# Altium schematic sheet Analog.SchDoc
size A3
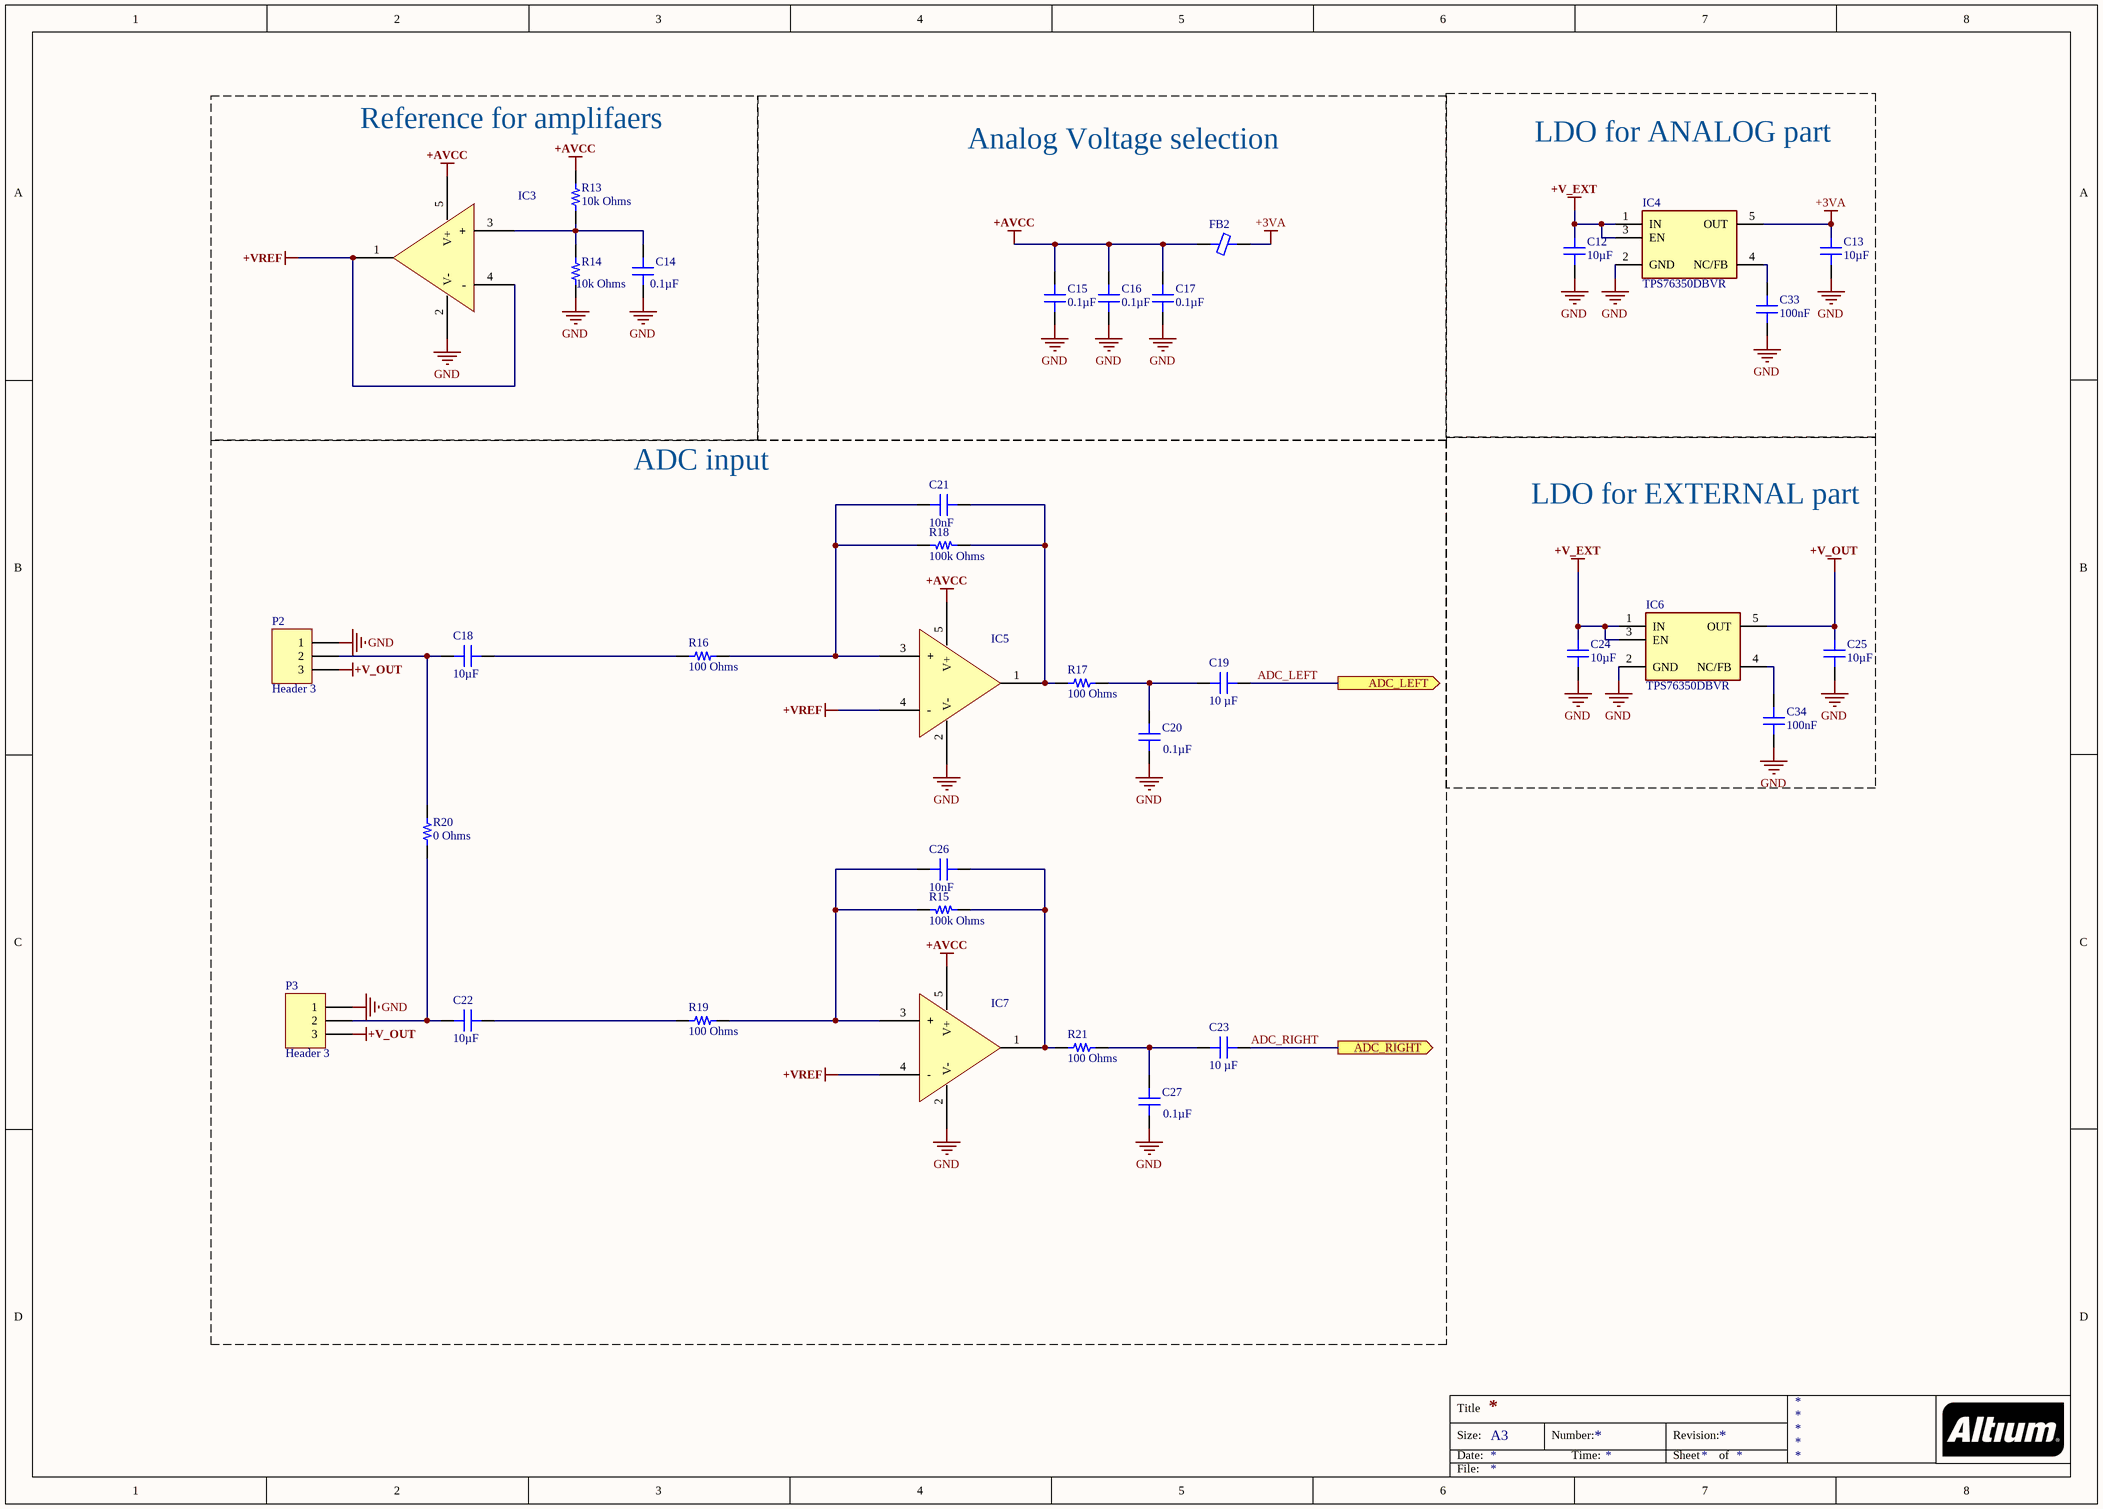
[diagram p0: Analog.SchDoc]

## Parts
C12  10µF  [CAP 0603_1608]
C13  10µF  [CAP 0603_1608]
C14  0.1µF  [CAP 0603_1608]
C15  0.1µF  [CAP 0603_1608]
C16  0.1µF  [CAP 0603_1608]
C17  0.1µF  [CAP 0603_1608]
C18  10µF  [CAP 0603_1608]
C19  10 µF  [CAP 0603_1608]
C20  0.1µF  [CAP 0603_1608]
C21  10nF  [CAP 0603_1608]
C22  10µF  [CAP 0603_1608]
C23  10 µF  [CAP 0603_1608]
C24  10µF  [CAP 0603_1608]
C25  10µF  [CAP 0603_1608]
C26  10nF  [CAP 0603_1608]
C27  0.1µF  [CAP 0603_1608]
C33  100nF  [CAP 0603_1608]
C34  100nF  [CAP 0603_1608]
FB2  (no value)  [FER 0603_1608]
IC3  AD8541ARTZ-REEL7  [ANALOG SOT-23-5 RJ-5]  (value not drawn)
IC4  TPS76350DBVR  [SOT95P280X145-5N]
IC5  AD8541ARTZ-REEL7  [ANALOG SOT-23-5 RJ-5]  (value not drawn)
IC6  TPS76350DBVR  [SOT95P280X145-5N]
IC7  AD8541ARTZ-REEL7  [ANALOG SOT-23-5 RJ-5]  (value not drawn)
P2  Header 3  [HDR1X3]
P3  Header 3  [HDR1X3]
R13  10k Ohms  [RES 0603_1608]
R14  10k Ohms  [RES 0603_1608]
R15  100k Ohms  [RES 0603_1608]
R16  100 Ohms  [RES 0603_1608]
R17  100 Ohms  [RES 0603_1608]
R18  100k Ohms  [RES 0603_1608]
R19  100 Ohms  [RES 0603_1608]
R20  0 Ohms  [RES 0603_1608]
R21  100 Ohms  [RES 0603_1608]

## Ports
ADC_LEFT (out), ADC_RIGHT (out)

## Nets
+3VA: C13.2 FB2.2 IC4.5(OUT)
+AVCC: C15.2 C16.2 C17.2 FB2.1 IC3.5(V+) IC5.5(V+) IC7.5(V+) R13.2
+V_EXT: C12.2 C24.2 IC4.1(IN) IC4.3(EN) IC6.1(IN) IC6.3(EN)
+V_OUT: C25.2 IC6.5(OUT) P2.3 P3.3
+VREF: IC3.1(OUT) IC3.4(-) IC5.4(-) IC7.4(-)
GND: C12.1 C13.1 C14.1 C15.1 C16.1 C17.1 C20.1 C24.1 C25.1 C27.1 C33.1 C34.1 IC3.2(V-) IC4.2(GND) IC5.2(V-) IC6.2(GND) IC7.2(V-) P2.1 P3.1 R14.1
ADC_LEFT: C19.2 ; port ADC_LEFT
ADC_RIGHT: C23.2 ; port ADC_RIGHT
NetC14_2: C14.2 IC3.3(+) R13.1 R14.2
NetC18_1: C18.1 R16.2
NetC18_2: C18.2 P2.2 R20.1
NetC19_1: C19.1 C20.2 R17.1
NetC21_1: C21.1 IC5.1(OUT) R17.2 R18.1
NetC21_2: C21.2 IC5.3(+) R16.1 R18.2
NetC22_1: C22.1 R19.2
NetC22_2: C22.2 P3.2 R20.2
NetC23_1: C23.1 C27.2 R21.1
NetC26_1: C26.1 IC7.1(OUT) R15.1 R21.2
NetC26_2: C26.2 IC7.3(+) R15.2 R19.1
NetC33_2: C33.2 IC4.4(NC/FB)
NetC34_2: C34.2 IC6.4(NC/FB)

## Notes on the sheet
- (near R13) Reference for amplifaers
- Analog Voltage selection
- LDO for ANALOG part
- ADC input
- LDO for EXTERNAL part
- Title
- Size:
- Date:
- A3
- Number:
- Time:
- Revision:
- Sheet
- of
- File:

## Library data of the parts
C12-C27 C33 C34 = 100X14W104MV4T: CAP CER 0.1UF 10V X7R 0603; Part Number: 100X14W104MV4T
  C12 C13 C18 C22 C24 C25: Value: 10µF
  C14-C17 C20 C27: Value: 0.1µF
  C19 C23: Value: 10 µF
  C21 C26: Value: 10nF
  C33 C34: Value: 100nF
FB2 = 2506031217H0: FERRITE BEAD 0603 1LN; Part Number: 2506031217H0
IC3 IC5 IC7 = AD8541ARTZ-REEL7: IC OPAMP GP 1 CIRCUIT SOT23-5; Manufacturer: Analog Devices Inc.; Amplifier Type: General Purpose; Current - Input Bias: 4pA; Current - Output / Channel: 30mA; Current - Supply: 45µA; Gain Bandwidth Product: 1MHz; Number of Circuits: 1; Output Type: Rail-to-Rail; Slew Rate: 0.92V/µs; Voltage - Input Offset: 1mV; Voltage - Supply, Single/Dual (±): 2.7V ~ 5.5V; Part Number: AD8541ARTZ-REEL7; ComponentLink1Description: Datasheet; ComponentLink1URL: https://www.analog.com/media/en/technical-documentation/data-sheets/AD8541_8542_8544.pdf; ComponentLink2Description: DigiKey Link; ComponentLink2URL: http://digikey.com/product-detail/en/analog-devices-inc/AD8541ARTZ-REEL7/AD8541ARTZ-REEL7CT-ND/813416; Device Package: SC-74A, SOT-753; LastUpdated: 08.01.2020 23:39:15; Lifecycle Status: Active; Minimum Order: 1; Mounting Type: Surface Mount; Operating Temperature: -40°C ~ 125°C; Package / Case: SC-74A, SOT-753; Packaging: ReReel; PartId: 9; Part Status: Active; Price: 0.00; Series: -; Supplier 1: DigiKey; Supplier Part Number 1: AD8541ARTZ-REEL7CT-ND; Supplier Device Package: SOT-23-5
IC4 IC6 = TPS76350DBVR: Integrated Circuit; Manufacturer_Name: Texas Instruments; Datasheet Link: https://www.ti.com/lit/gpn/TPS763; Height: 1.45mm; Manufacturer_Part_Number: TPS76350DBVR; Mouser Part Number: 595-TPS76350DBVR; Mouser Price/Stock: https://www.mouser.co.uk/ProductDetail/Texas-Instruments/TPS76350DBVR?qs=8yeEWhuAOtMYKUfRRdAKSw%3D%3D; Arrow Part Number: TPS76350DBVR; Arrow Price/Stock: https://www.arrow.com/en/products/tps76350dbvr/texas-instruments
P2 P3 = Header 3: Header, 3-Pin; LatestRevisionDate: 17-Jul-2002; LatestRevisionNote: Re-released for DXP Platform.; Publisher: Altium Limited
R13-R21 = RNCS0603BKE100R: RES 100 OHM 0.1% 1/16W 0603; Part Number: RNCS0603BKE100R
  R13 R14: Value: 10k Ohms
  R15 R18: Value: 100k Ohms
  R16 R17 R19 R21: Value: 100 Ohms
  R20: Value: 0 Ohms